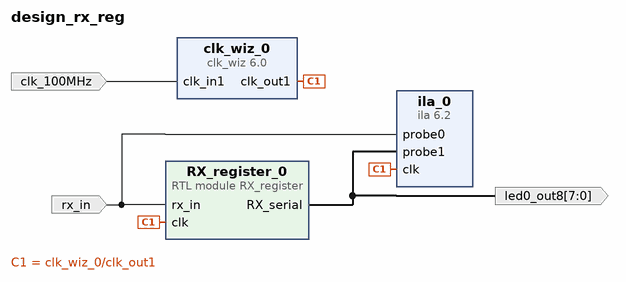
[diagram p0: block diagram of the top level]
# Vivado block design design_rx_reg, xc7a35tcpg236-1, Vivado 2020.1
create_bd_design design_rx_reg

create_bd_port -dir O -from 7 -to 0 led0_out8
create_bd_port -dir I rx_in
create_bd_port -dir I -type clk clk_100MHz

create_bd_cell -type ip -vlnv xilinx.com:ip:clk_wiz:6.0 clk_wiz_0
create_bd_cell -type ip -vlnv xilinx.com:ip:ila:6.2 ila_0
set_property -dict [list \
  CONFIG.ALL_PROBE_SAME_MU_CNT 1 \
  CONFIG.C_ENABLE_ILA_AXI_MON false \
  CONFIG.C_MONITOR_TYPE Native \
  CONFIG.C_NUM_OF_PROBES 2 \
  CONFIG.C_PROBE0_MU_CNT 1 \
  CONFIG.C_PROBE0_WIDTH 1 \
  CONFIG.C_PROBE1_WIDTH 8 \
] [get_bd_cells ila_0]
create_bd_cell -type module -reference RX_register RX_register_0

# ---- connections ----

connect_bd_net [get_bd_pins clk_wiz_0/clk_out1] [get_bd_pins ila_0/clk] [get_bd_pins RX_register_0/clk]
connect_bd_net -net rx_in_0_1 [get_bd_ports rx_in] [get_bd_pins ila_0/probe0] [get_bd_pins RX_register_0/rx_in]
connect_bd_net [get_bd_pins RX_register_0/RX_serial] [get_bd_pins ila_0/probe1] [get_bd_ports led0_out8]
connect_bd_net -net clk_in1_0_1 [get_bd_ports clk_100MHz] [get_bd_pins clk_wiz_0/clk_in1]

validate_bd_design
save_bd_design
